# Altium schematic sheet voltage regulator.SchDoc
size A
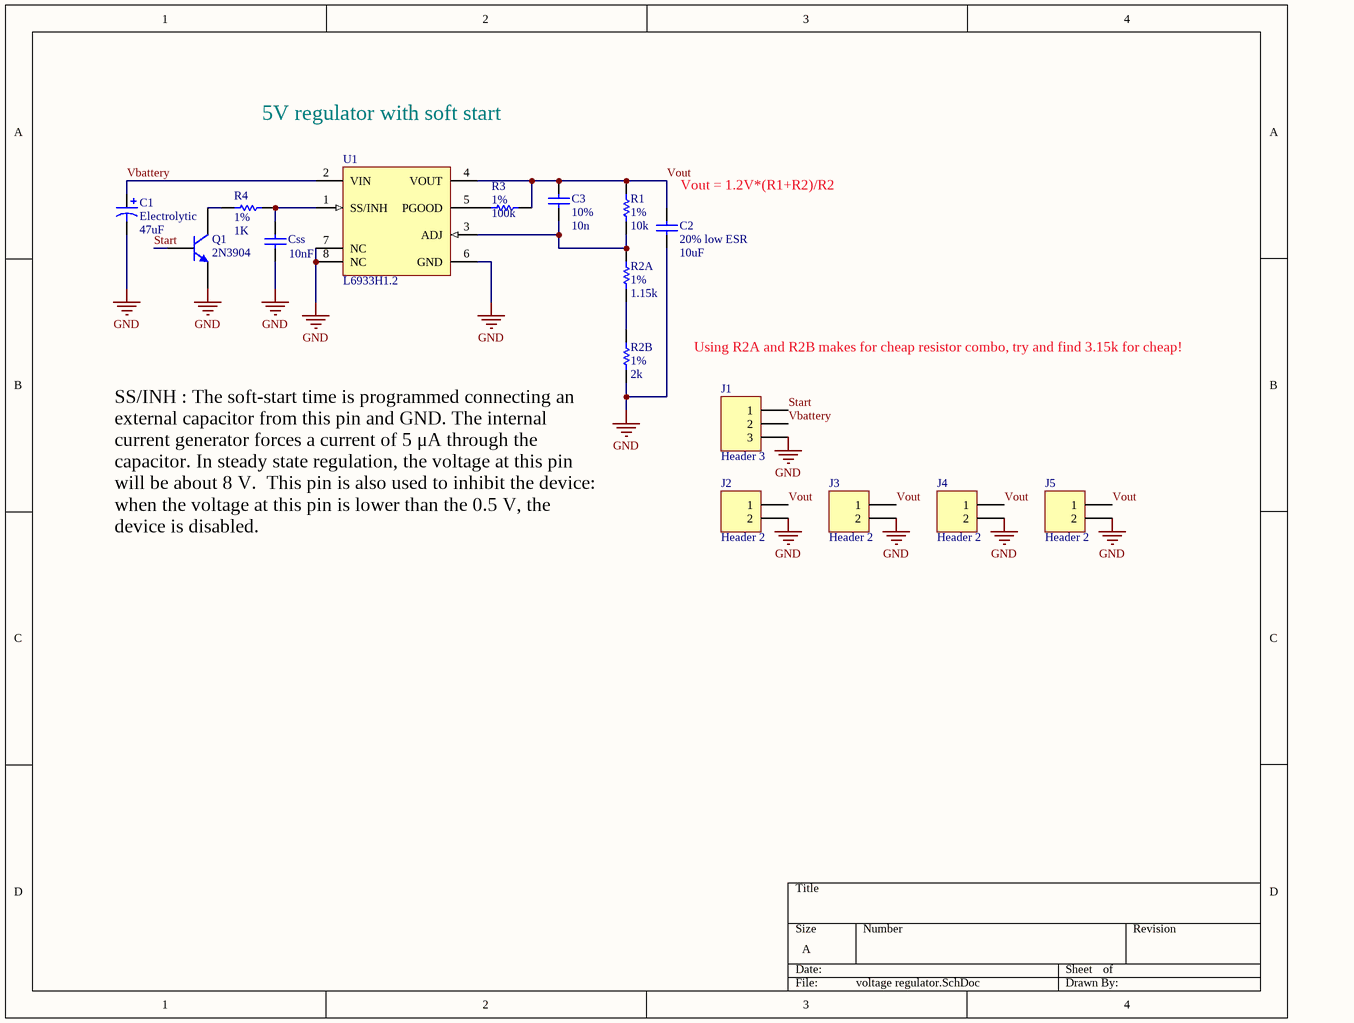
[diagram p0: voltage regulator.SchDoc]

## Parts
C1  Electrolytic  value 47uF  [RAD-0.3]
C2  20% low ESR  value 10uF  [C1206]
C3  10%  value 10n  [6-0805_M]
Css  value 10nF  [6-0805_M]  (hidden comment: 10%, 10 nF, 16 V (min))
J1  Header 3  [HDR1X3]
J2  Header 2  [HDR1X2]
J3  Header 2  [HDR1X2]
J4  Header 2  [HDR1X2]
J5  Header 2  [HDR1X2]
Q1  2N3904  [TO-92A]
R1  1%  value 10k  [6-0805_M]
R2A  1%  value 1.15k  [6-0805_M]
R2B  1%  value 2k  [6-0805_M]
R3  1%  value 100k  [6-0805_M]
R4  1%  value 1K  [6-0805_M]
U1  L6933H1.2  [SO8_M]

## Nets
GND: C1.2 C2.1 Css.1 J1.3 J2.2 J3.2 J4.2 J5.2 Q1.1(E) R2B.1 U1.6(GND) U1.7(NC) U1.8(NC)
Start: J1.1 Q1.2(B)
Vbattery: C1.1 J1.2 U1.2(VIN)
Vout: C2.2 C3.2 J2.1 J3.1 J4.1 J5.1 R1.2 R3.2 U1.4(VOUT)
NetC3_1: C3.1 R1.1 R2A.2 U1.3(ADJ)
NetCss_2: Css.2 R4.2 U1.1(SS/INH)
NetQ1_3: Q1.3(C) R4.1
NetR2A_1: R2A.1 R2B.2
NetR3_1: R3.1 U1.5(PGOOD)

## Notes on the sheet
- 5V regulator with soft start
- (near C2) Vout = 1.2V*(R1+R2)/R2
- Using R2A and R2B makes for cheap resistor combo, try and find 3.15k for cheap!
- (near R2B) SS/INH : The soft-start time is programmed connecting an external capacitor from this pin and GND. The internal current generator forces a current of 5 μA through the capacitor. In steady state regulation, the voltage at this pin will be about 8 V.  This pin is also used to inhibit the device: when the voltage at this pin is lower than the 0.5 V, the device is disabled.

## Library data of the parts
C1 = Cap Pol1: Polarized Capacitor (Radial); manufacture: UPJ1C470MDD1TD; Published: 8-Jun-2000; LatestRevisionDate: 17-Jul-2002; LatestRevisionNote: Re-released for DXP Platform.; PackageReference: RB7.6-15; Publisher: Altium Limited; PackageDescription: Polarized Capacitor (Radial); 2 Leads; Supplier Part Number 1: 493-11373-1-ND; Supplier 1: Digikey
C2 = Cap: Capacitor; manufacture: 100R15X106KV4E; Published: 8-Jun-2000; LatestRevisionDate: 17-Jul-2002; LatestRevisionNote: Re-released for DXP Platform.; PackageReference: RAD-0.3; Publisher: Altium Limited; PackageDescription: Radial Cap, Thru-Hole; 2 Leads; 0.3 in Pin Spacing; Supplier Part Number 1: 709-1228-1-ND; Supplier 1: Digikey
C3 = Cap: Capacitor; manufacture: 885012007016; Published: 8-Jun-2000; LatestRevisionDate: 17-Jul-2002; LatestRevisionNote: Re-released for DXP Platform.; PackageReference: RAD-0.3; Publisher: Altium Limited; PackageDescription: Radial Cap, Thru-Hole; 2 Leads; 0.3 in Pin Spacing; Supplier Part Number 1: 732-7820-1-ND; Supplier 1: digikey
Css = Cap: Capacitor; manufacture: CC0805KRX7R9BB103; Published: 8-Jun-2000; LatestRevisionDate: 17-Jul-2002; LatestRevisionNote: Re-released for DXP Platform.; PackageReference: RAD-0.3; Publisher: Altium Limited; PackageDescription: Radial Cap, Thru-Hole; 2 Leads; 0.3 in Pin Spacing; Supplier Part Number 1: 311-1136-1-ND; Supplier 1: digikey
J1 = Header 3: Header, 3-Pin; LatestRevisionDate: 17-Jul-2002; LatestRevisionNote: Re-released for DXP Platform.; Publisher: Altium Limited; Supplier Part Number 1: A19890-ND; Supplier 1: Digikey
J2-J5 = Header 2: Header, 2-Pin; LatestRevisionDate: 17-Jul-2002; LatestRevisionNote: Re-released for DXP Platform.; Publisher: Altium Limited; Supplier Part Number 1: A1971-ND; Supplier 1: Digikey
Q1 = 2N3904: NPN General Purpose Amplifier; Published: 8-Jun-2000; LatestRevisionDate: 15-Jan-2003; LatestRevisionNote: PCB Footprint 'BCY-W3/D4.7' replaced; DatasheetVersion: 1997; PackageVersion: Sep-1998; PackageReference: TO-92A; Publisher: Altium Limited; PackageDescription: TO, Flat Index; 3 In-Line, Axial Leads; Body Dia. 4.5mm; Leads 0.51 x 0.48 mm (max); ComponentLink1Description: Manufacturer Link; ComponentLink1URL: http://www.fairchildsemi.com/; ComponentLink2Description: Datasheet; ComponentLink2URL: http://www.fairchildsemi.com/ds/2N%2F2N3904.pdf; Supplier Part Number 1: 2N3904FS-ND; Supplier 1: Digikey
R1 = Res1: Resistor; manufacture: RC0805FR-0710KL; Published: 8-Jun-2000; LatestRevisionDate: 17-Jul-2002; LatestRevisionNote: Re-released for DXP Platform.; PackageReference: AXIAL-0.3; Publisher: Altium Limited; PackageDescription: Axial Device, Thru-Hole; 2 Leads; 0.3 in Pin Spacing; Supplier Part Number 1: 311-10.0KCRCT-ND; Supplier 1: digikey
R2A = Res1: Resistor; manufacture: RC0805FR-071K15L; Published: 8-Jun-2000; LatestRevisionDate: 17-Jul-2002; LatestRevisionNote: Re-released for DXP Platform.; PackageReference: AXIAL-0.3; Publisher: Altium Limited; PackageDescription: Axial Device, Thru-Hole; 2 Leads; 0.3 in Pin Spacing; Supplier Part Number 1: 311-1.15KCRCT-ND; Supplier 1: Digikey
R2B = Res1: Resistor; manufacture: RC0805FR-072KL; Published: 8-Jun-2000; LatestRevisionDate: 17-Jul-2002; LatestRevisionNote: Re-released for DXP Platform.; PackageReference: AXIAL-0.3; Publisher: Altium Limited; PackageDescription: Axial Device, Thru-Hole; 2 Leads; 0.3 in Pin Spacing; Supplier Part Number 1: 311-2.00KCRCT-ND; Supplier 1: Digikey
R3 = Res1: Resistor; manufacture: RC0805FR-07100KL; Published: 8-Jun-2000; LatestRevisionDate: 17-Jul-2002; LatestRevisionNote: Re-released for DXP Platform.; PackageReference: AXIAL-0.3; Publisher: Altium Limited; PackageDescription: Axial Device, Thru-Hole; 2 Leads; 0.3 in Pin Spacing; Supplier Part Number 1: 311-100KCRCT-ND; Supplier 1: digikey
R4 = Res1: Resistor; manufacture: RC0805FR-071KL; Published: 8-Jun-2000; LatestRevisionDate: 17-Jul-2002; LatestRevisionNote: Re-released for DXP Platform.; PackageReference: AXIAL-0.3; Publisher: Altium Limited; PackageDescription: Axial Device, Thru-Hole; 2 Leads; 0.3 in Pin Spacing; Supplier Part Number 1: 311-1.00KCRCT-ND; Supplier 1: Digikey
U1 = CMP-0240-00057-1: High Performance 2A ULDO Linear Regulator with Soft Start, 8-Pin SO; Code_JEDEC: MS-012-AA; PackageReference: SO8; ComponentLink3Description: Package Specification; ComponentLink1Description: Manufacturer URL; ComponentLink2Description: Datasheet; PackageVersion: Dec-2002; DatasheetVersion: Nov-2007; PackageDescription: 8-Pin Small Outline Integrated Circuit 1.27 mm Pitch; Code_IPC: SOIC127P600-8; ComponentLink2URL: http://www.st.com/internet/com/TECHNICAL_RESOURCES/TECHNICAL_LITERATURE/DATASHEET/CD00148469.pdf; ComponentLink1URL: http://www.st.com; ComponentLink3URL: http://www.st.com/internet/com/TECHNICAL_RESOURCES/TECHNICAL_LITERATURE/PACKAGE_INFORMATION/CD00004680.pdf; Supplier Part Number 1: 497-7766-1-ND; Supplier 1: Digikey